# EAGLE schematic oxygen sensing (EAGLE 9.6.2)
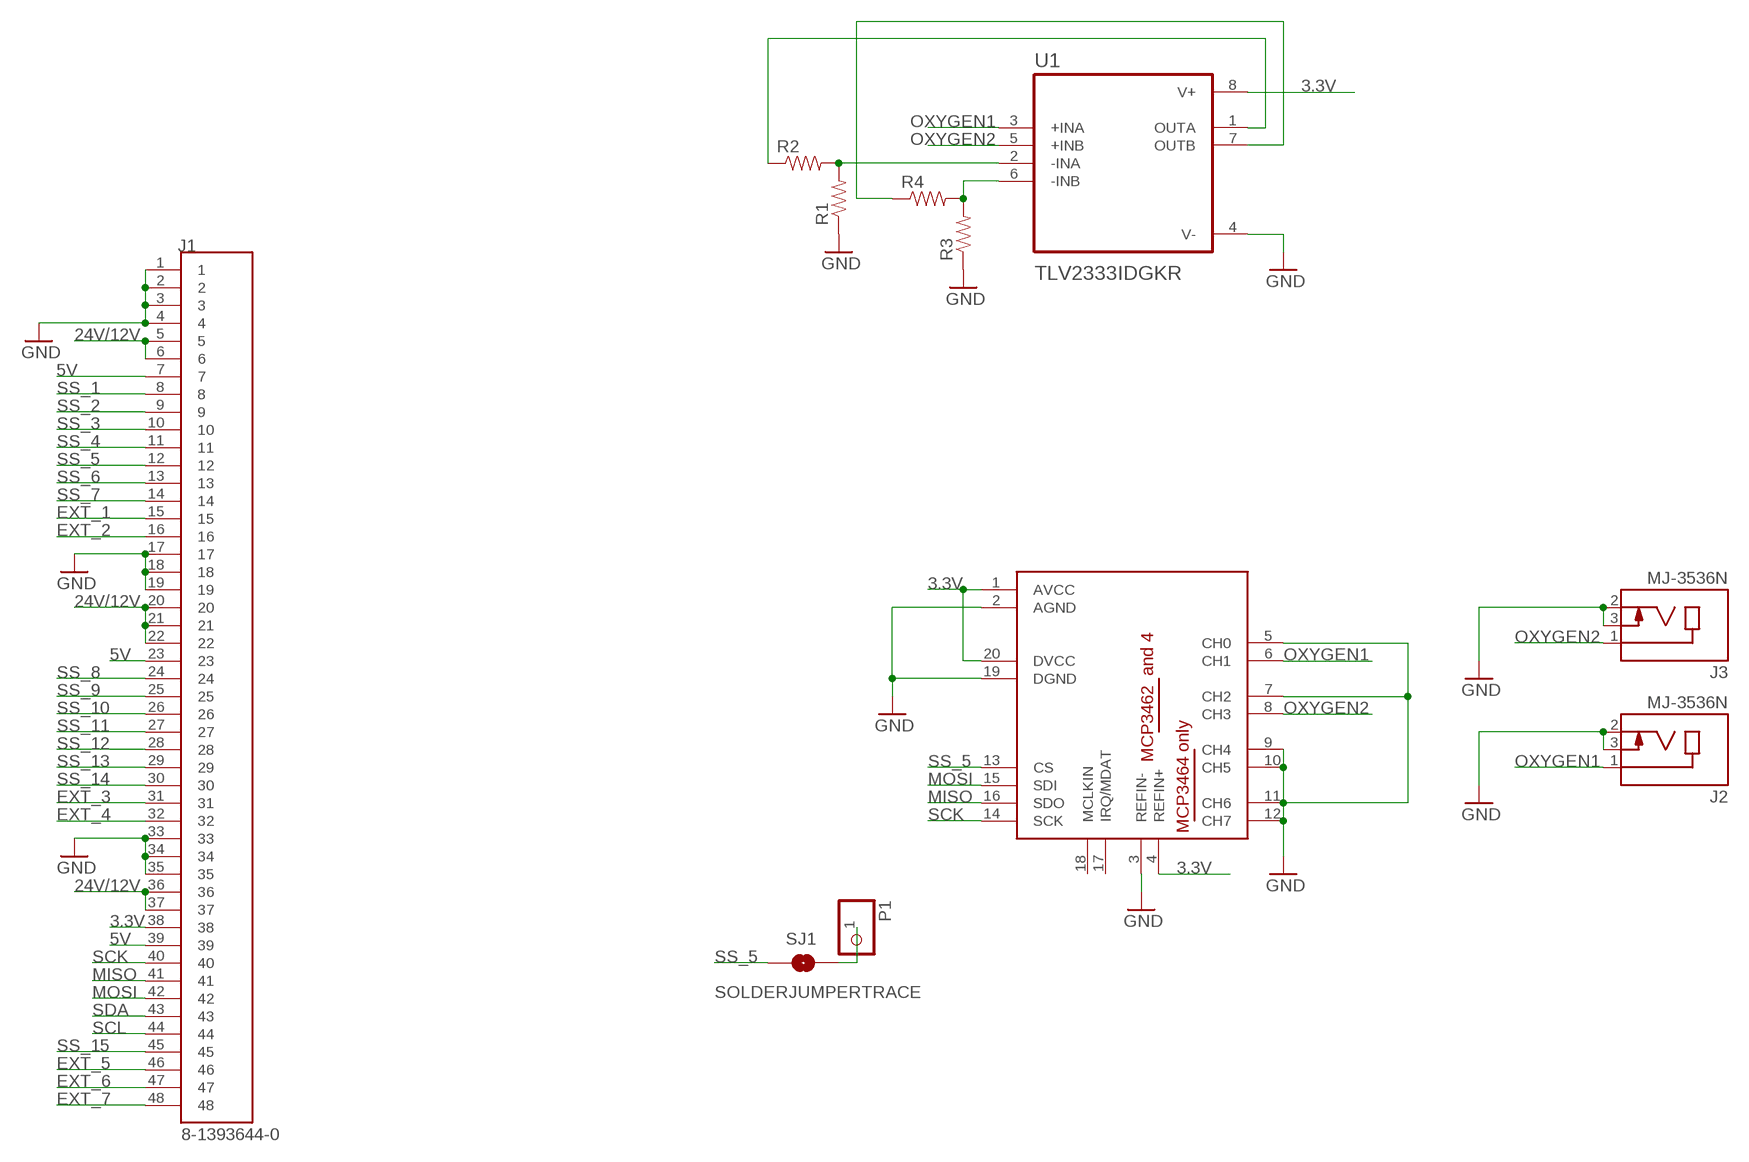
[diagram p0: schematic, sheet 1]

## Parts
J1  8-1393644-0  [TE_8-1393644-0]
J2  MJ-3536N  [CUI_MJ-3536N]
J3  MJ-3536N  [CUI_MJ-3536N]
P1  PINHD-1X1  [1X01]
R1  RESISTOR0805-RES  [0805]
R2  RESISTOR0805-RES  [0805]
R3  RESISTOR0805-RES  [0805]
R4  RESISTOR0805-RES  [0805]
SJ1  SOLDERJUMPERTRACE  [SJ_2S-TRACE]
U1  TLV2333IDGKR  [SOP65P490X110-8N]
U$1  MCP346X-E/ST  [TSSOP20]

## Nets
3.3V: J1.38 U1.8(V+) U$1.1(AVCC) U$1.4(REFIN+) U$1.20(DVCC)
5V: J1.7 J1.23 J1.39
24V/12V: J1.5 J1.6 J1.20 J1.21 J1.22 J1.36 J1.37
EXT_1: J1.15
EXT_2: J1.16
EXT_3: J1.31
EXT_4: J1.32
EXT_5: J1.46
EXT_6: J1.47
EXT_7: J1.48
GND: J1.1 J1.2 J1.3 J1.4 J1.17 J1.18 J1.19 J1.33 J1.34 J1.35 J2.2 J2.3 J3.2 J3.3 R1.1 R3.1 U1.4(V-) U$1.2(AGND) U$1.3(REFIN-) U$1.5(CH0) U$1.7(CH2) U$1.9(CH4) U$1.10(CH5) U$1.11(CH6) U$1.12(CH7) U$1.19(DGND)
MISO: J1.41 U$1.16(SDO)
MOSI: J1.42 U$1.15(SDI)
N$1: R1.2 R2.2 U1.2(-INA)
N$2: R3.2 R4.2 U1.6(-INB)
N$3: P1.1 SJ1.2
N$4: R2.1 U1.1(OUTA)
N$5: R4.1 U1.7(OUTB)
OXYGEN1: J2.1 U1.3(+INA) U$1.6(CH1)
OXYGEN2: J3.1 U1.5(+INB) U$1.8(CH3)
SCK: J1.40 U$1.14(SCK)
SCL: J1.44
SDA: J1.43
SS_1: J1.8
SS_2: J1.9
SS_3: J1.10
SS_4: J1.11
SS_5: J1.12 SJ1.1 U$1.13(CS)
SS_6: J1.13
SS_7: J1.14
SS_8: J1.24
SS_9: J1.25
SS_10: J1.26
SS_11: J1.27
SS_12: J1.28
SS_13: J1.29
SS_14: J1.30
SS_15: J1.45
Unconnected: U$1.17(IRQ/MDAT) U$1.18(MCLKIN)

## Library data of the parts
J1 = 8-1393644-0:8-1393644-0: Check prices <https://pricing.snapeda.com/parts/8-1393644-0/TE%20Connectivity/view-part?ref=eda>; AVAILABILITY: In Stock; COMMENT: 8-1393644-0; DESCRIPTION: Conn DIN 41612 M 48 POS 2.54mm Solder RA Thru-Hole Tray; EU_ROHS_COMPLIANCE: Compliant; MF: TE Connectivity; MP: 8-1393644-0; PACKAGE: None; PRICE: None; PURCHASE-URL: https://pricing.snapeda.com/search/part/8-1393644-0/?ref=eda
J2 J3 = MJ-3536N:MJ-3536N: 2 Conductors 3 Contacts 12V 3.5 mm Right Angle Through Hole Audio Jack Connector; ARROW_ELECTRONICS-PURCHASE-URL: https://snapeda.com/shop?store=Arrow+Electronics&id=559067; AVAILABILITY: Unavailable; CUI_PURCHASE_URL: https://www.cuidevices.com/product/interconnect/connectors/audio-connectors/jacks/mj-3536n?utm_source=snapeda.com&utm_medium=referral&utm_campaign=snapedaBOM; DESCRIPTION: 3.5 mm, Mono, Right Angle, Through Hole, Audio Jack Connector; DIGIKEY-PURCHASE-URL: https://snapeda.com/shop?store=DigiKey&id=559067; MF: CUI Devices; MOUSER-PURCHASE-URL: https://snapeda.com/shop?store=Mouser&id=559067; MP: MJ-3536N; PACKAGE: None; PRICE: None
P1 = pinhead:PINHD-1X1: PIN HEADER
R1-R4 = SparkFun-Passives:RESISTOR: Resistor Basic schematic elements and footprints for 0603, 1206, and PTH resistors.
SJ1 = SparkFun-Passives:SOLDERJUMPER: Solder Jumper Standard SMD solder jumper. Used to automate production. Two varients : Normally Open and Normally Closed are the same, but have different paste layers. NC will have a large amount of paste and should jumper during reflow.
U1 = TLV2333IDGKR:TLV2333IDGKR: Check prices <https://pricing.snapeda.com/parts/TLV2333IDGKR/Texas%20Instruments/view-part?ref=eda>; AVAILABILITY: In Stock; DESCRIPTION: Dual, 350 kHz, Low-Noise, RRIO, CMOS Operational Amplifier for Cost-Sensitive Systems 8-VSSOP -40 to 125; MF: Texas Instruments; MP: TLV2333IDGKR; PACKAGE: VSSOP-8 Texas Instruments; PRICE: None; PURCHASE-URL: https://pricing.snapeda.com/search/part/TLV2333IDGKR/?ref=eda
U$1 = MCP346XRT-E:ST:MCP346X-E/ST